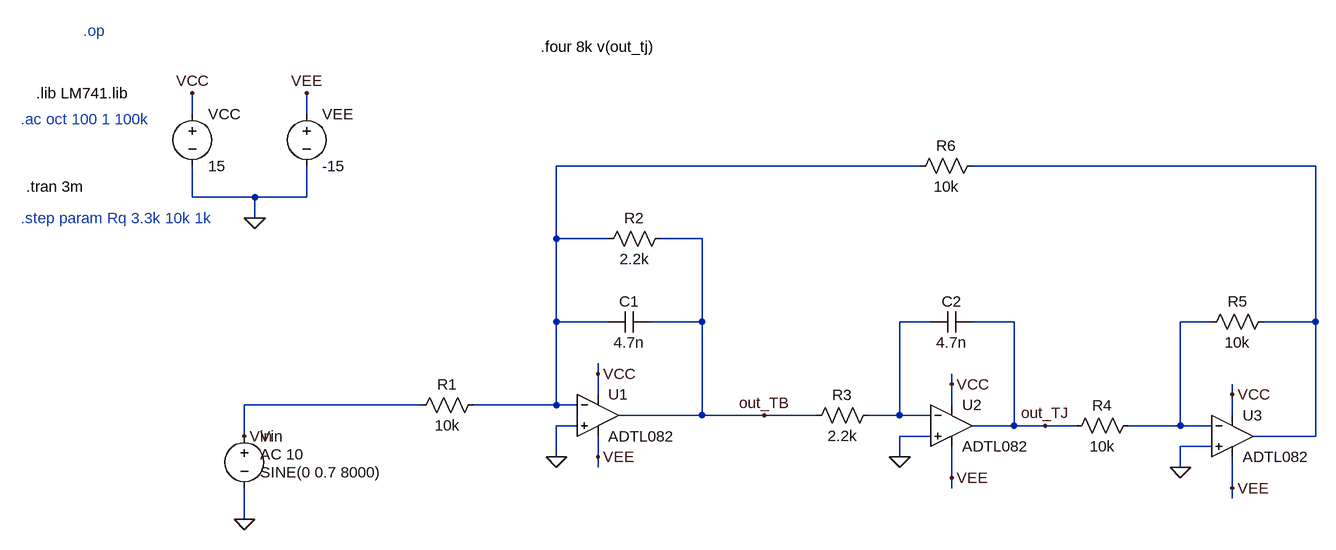
[diagram p0: schematic Filtre_Tow_Thomas.asc]
Filtre_Tow_Thomas.asc, the LTspice schematic file:
Version 4
SHEET 1 2228 1120
WIRE 400 -32 400 -64
WIRE 576 -32 576 -64
WIRE 1520 48 960 48
WIRE 2128 48 1600 48
WIRE 400 96 400 48
WIRE 496 96 400 96
WIRE 576 96 576 48
WIRE 576 96 496 96
WIRE 496 128 496 96
WIRE 960 160 960 48
WIRE 1040 160 960 160
WIRE 1184 160 1120 160
WIRE 960 288 960 160
WIRE 1040 288 960 288
WIRE 1184 288 1184 160
WIRE 1184 288 1104 288
WIRE 1536 288 1488 288
WIRE 1664 288 1600 288
WIRE 1968 288 1920 288
WIRE 2128 288 2128 48
WIRE 2128 288 2048 288
WIRE 1024 368 1024 352
WIRE 1568 384 1568 368
WIRE 1024 400 1024 368
WIRE 2000 400 2000 384
WIRE 752 416 480 416
WIRE 960 416 960 288
WIRE 960 416 832 416
WIRE 992 416 960 416
WIRE 1568 416 1568 384
WIRE 1184 432 1184 288
WIRE 1184 432 1056 432
WIRE 1280 432 1184 432
WIRE 1360 432 1280 432
WIRE 1488 432 1488 288
WIRE 1488 432 1440 432
WIRE 1536 432 1488 432
WIRE 2000 432 2000 400
WIRE 992 448 960 448
WIRE 1664 448 1664 288
WIRE 1664 448 1600 448
WIRE 1712 448 1664 448
WIRE 1760 448 1712 448
WIRE 1920 448 1920 288
WIRE 1920 448 1840 448
WIRE 1968 448 1920 448
WIRE 480 464 480 416
WIRE 1536 464 1488 464
WIRE 2128 464 2128 288
WIRE 2128 464 2032 464
WIRE 1968 480 1920 480
WIRE 960 496 960 448
WIRE 1024 496 1024 464
WIRE 1488 496 1488 464
WIRE 1024 512 1024 496
WIRE 1920 512 1920 480
WIRE 1568 528 1568 480
WIRE 1568 544 1568 528
WIRE 2000 544 2000 496
WIRE 2000 560 2000 544
WIRE 480 592 480 544
FLAG 400 -64 VCC
FLAG 576 -64 VEE
FLAG 960 496 0
FLAG 1488 496 0
FLAG 1920 512 0
FLAG 480 592 0
FLAG 496 128 0
FLAG 1024 368 VCC
FLAG 1568 384 VCC
FLAG 2000 400 VCC
FLAG 1024 496 VEE
FLAG 1568 528 VEE
FLAG 2000 544 VEE
FLAG 1712 448 out_TJ
FLAG 1280 432 out_TB
FLAG 480 464 Vin
SYMBOL voltage 400 -48 R0
WINDOW 123 0 0 Left 2
WINDOW 39 0 0 Left 2
SYMATTR InstName VCC
SYMATTR Value 15
SYMBOL voltage 576 -48 R0
WINDOW 123 0 0 Left 2
WINDOW 39 0 0 Left 2
SYMATTR InstName VEE
SYMATTR Value -15
SYMBOL res 848 400 R90
WINDOW 0 0 56 VBottom 2
WINDOW 3 32 56 VTop 2
SYMATTR InstName R1
SYMATTR Value 10k
SYMBOL res 1136 144 R90
WINDOW 0 0 56 VBottom 2
WINDOW 3 32 56 VTop 2
SYMATTR InstName R2
SYMATTR Value 2.2k
SYMBOL res 1456 416 R90
WINDOW 0 0 56 VBottom 2
WINDOW 3 32 56 VTop 2
SYMATTR InstName R3
SYMATTR Value 2.2k
SYMBOL res 1856 432 R90
WINDOW 0 0 56 VBottom 2
WINDOW 3 32 56 VTop 2
SYMATTR InstName R4
SYMATTR Value 10k
SYMBOL res 2064 272 R90
WINDOW 0 0 56 VBottom 2
WINDOW 3 32 56 VTop 2
SYMATTR InstName R5
SYMATTR Value 10k
SYMBOL cap 1104 272 R90
WINDOW 0 0 32 VBottom 2
WINDOW 3 32 32 VTop 2
SYMATTR InstName C1
SYMATTR Value 4.7n
SYMBOL cap 1600 272 R90
WINDOW 0 0 32 VBottom 2
WINDOW 3 32 32 VTop 2
SYMATTR InstName C2
SYMATTR Value 4.7n
SYMBOL voltage 480 448 R0
WINDOW 123 24 44 Left 2
WINDOW 39 0 0 Left 0
WINDOW 3 24 72 Left 2
SYMATTR Value2 AC 10
SYMATTR Value SINE(0 0.7 8000)
SYMATTR InstName Vin
SYMBOL res 1616 32 R90
WINDOW 0 0 56 VBottom 2
WINDOW 3 32 56 VTop 2
SYMATTR InstName R6
SYMATTR Value 10k
SYMBOL OpAmps\\ADTL082 1024 368 R0
SYMATTR InstName U1
SYMBOL OpAmps\\ADTL082 1568 384 R0
SYMATTR InstName U2
SYMBOL OpAmps\\ADTL082 2000 400 R0
SYMATTR InstName U3
TEXT 160 -64 Left 2 !.lib LM741.lib
TEXT 136 -24 Left 2 ;.ac oct 100 1 100k
TEXT 232 -160 Left 2 ;.op
TEXT 144 80 Left 2 !.tran 3m
TEXT 136 128 Left 2 ;.step param Rq 3.3k 10k 1k
TEXT 936 -136 Left 2 !.four 8k v(out_tj)

The netlist it stands for:
* Filtre_Tow_Thomas.asc
VCC VCC 0 15
VEE VEE 0 -15
R1 N001 Vin 10k
R2 out_TB N001 2.2k
R3 N003 out_TB 2.2k
R4 N004 out_TJ 10k
R5 N002 N004 10k
C1 out_TB N001 4.7n
C2 out_TJ N003 4.7n
Vin Vin 0 SINE(0 0.7 8000) AC 10
R6 N002 N001 10k
XU1 0 N001 VCC VEE out_TB ADTL082  ; pins In+ In- V+ V- OUT
XU2 0 N003 VCC VEE out_TJ ADTL082  ; pins In+ In- V+ V- OUT
XU3 0 N004 VCC VEE N002 ADTL082  ; pins In+ In- V+ V- OUT
.lib LM741.lib
* .ac oct 100 1 100k
* .op
.tran 3m
* .step param Rq 3.3k 10k 1k
.four 8k v(out_tj)
.lib ADI.lib
.backanno
.end